# EAGLE board AK-230_24-V3 (EAGLE 5.10), part 1 of 2
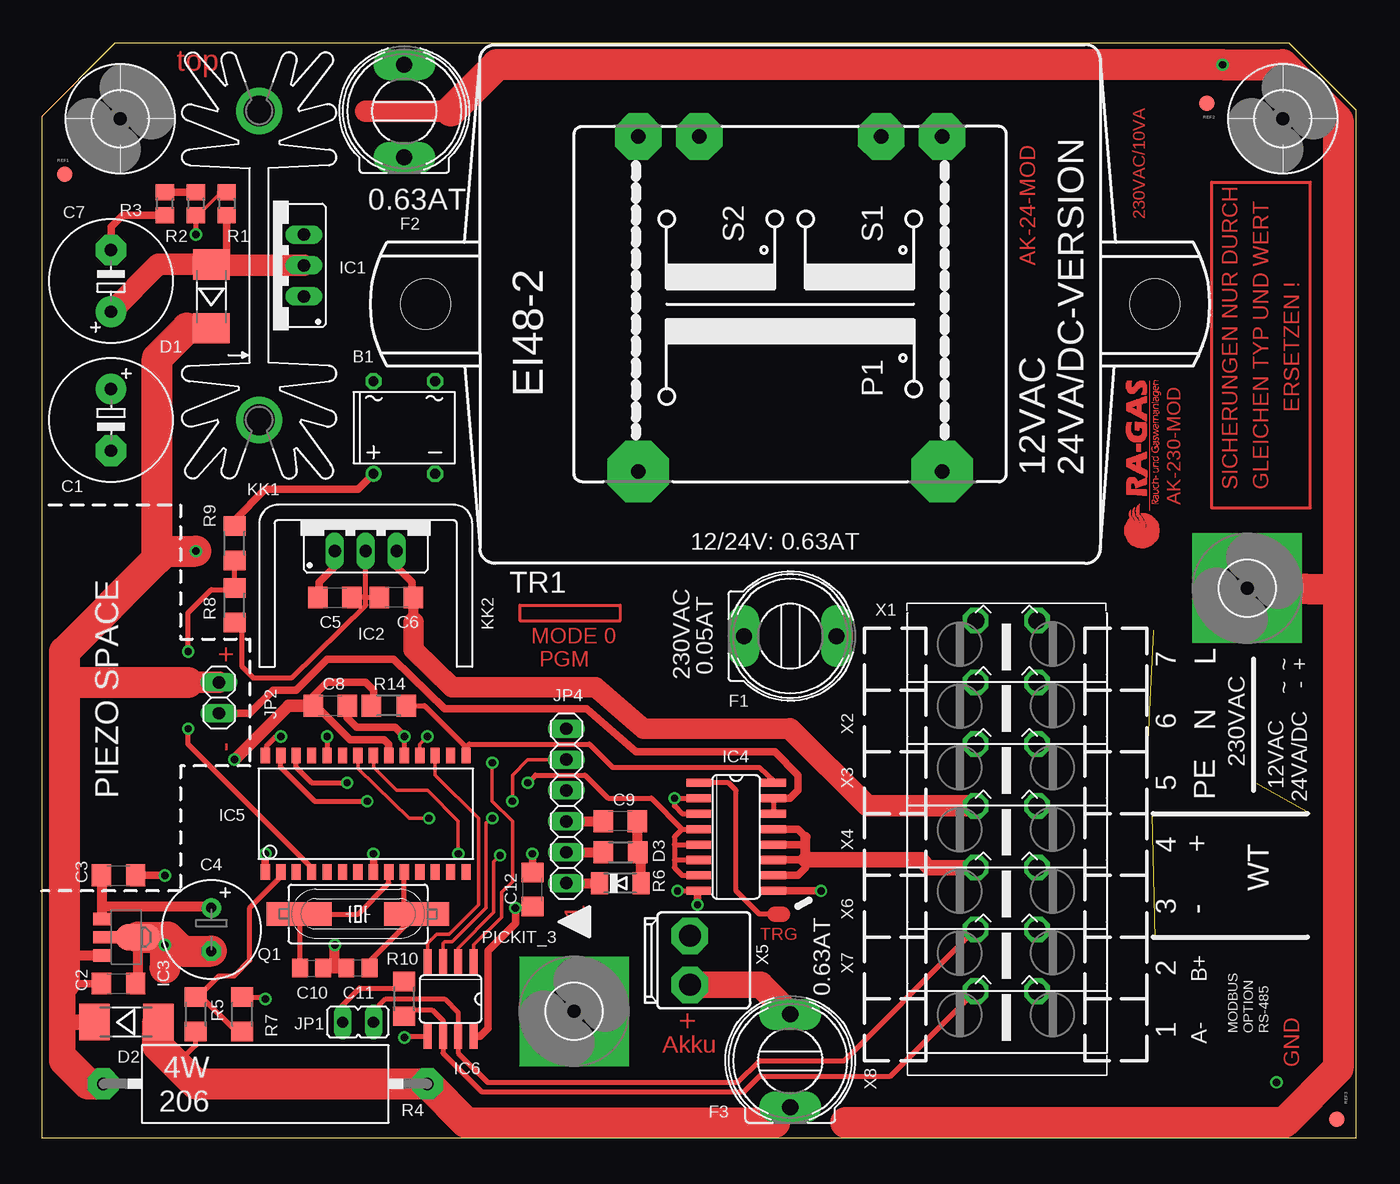
[diagram p1: board, top side]
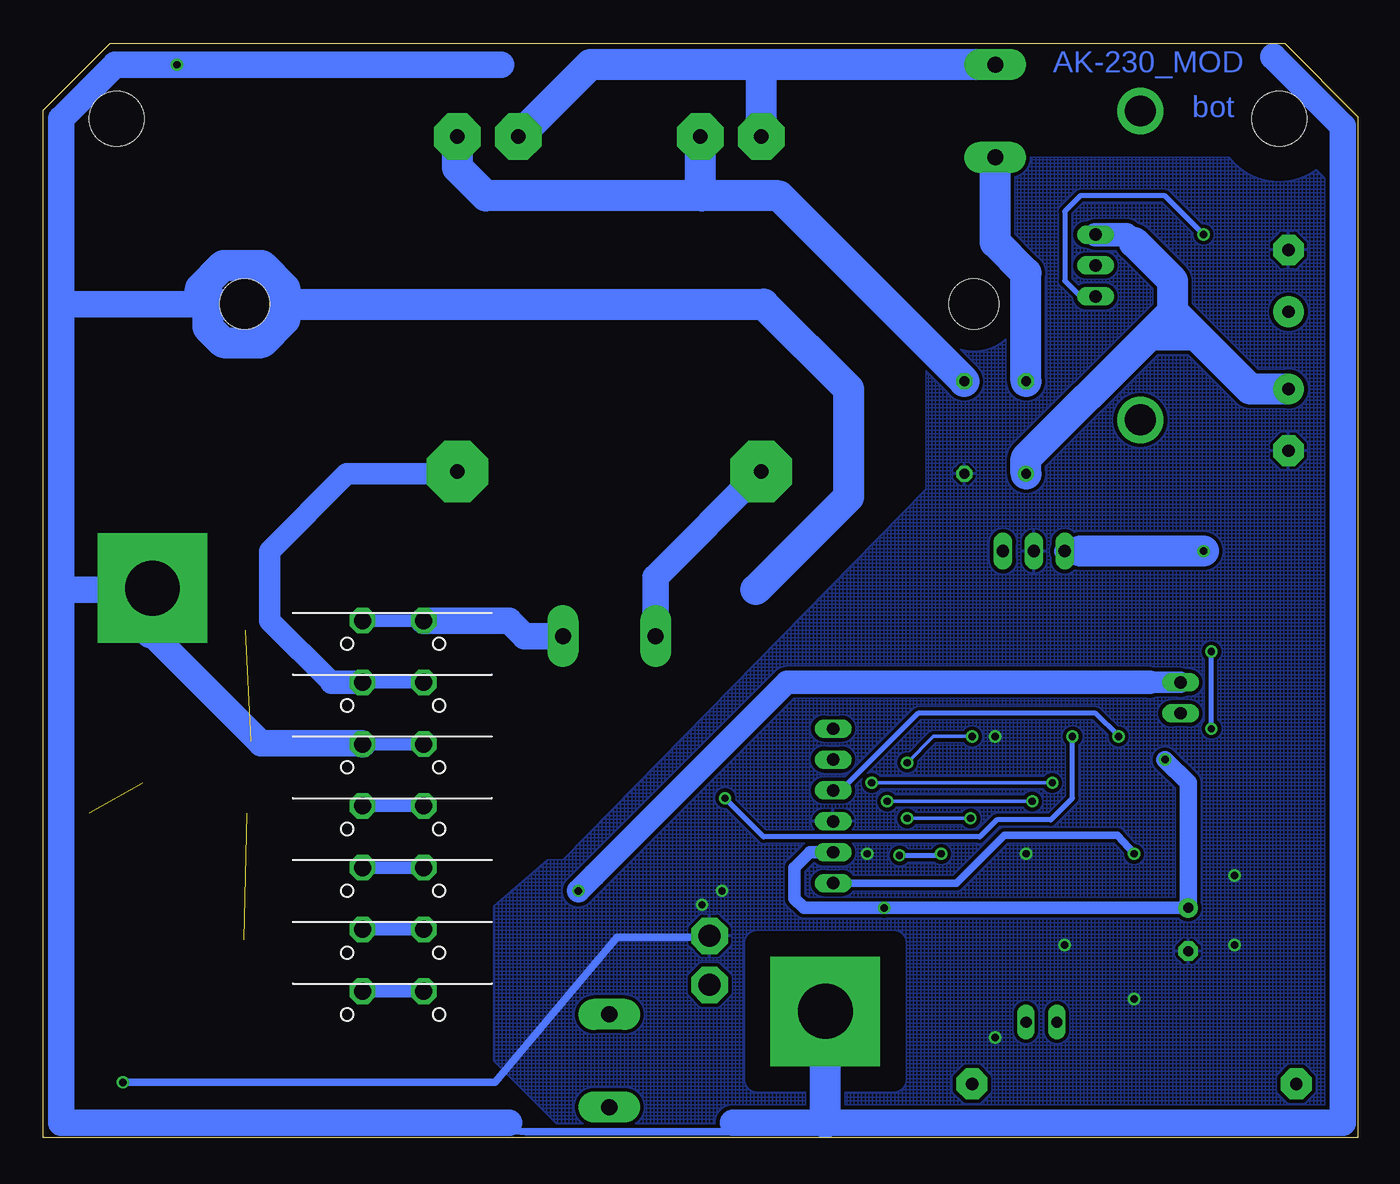
[diagram p2: board, bottom side, seen from below]

Size 108.15 x 90.02 mm. Coordinates in mm from the lower left corner, seen from the top.
Outline: 0,0 108.15,0 108.15,84.5 102.64,90.02 6.03,90.02 0,83.98 0,0
Copper layers (1*16): Top 0.035mm / dielectric 1.5mm / Bottom 0.035mm
Design rules "default *": minimum track width 0.1mm, minimum drill 23mil, track to track 0.3mm, track to pad 0.3mm, pad to pad 8mil, via to via 8mil, smd to smd 8mil, copper to edge 0.2mm, drill to drill 1mm, minimum pad ring 10mil, minimum via ring 8mil, stop-mask expansion 4mil, vias tented up to drill 0mil, thermal gap 10mil

## Footprints (pad centres in the part's own frame; a part is rotated, then mirrored left to right if it is on the bottom)
DB = drill 0.813 round: + -2.54,-3.81 | drill 0.813 octagon: - 2.54,-3.81; AC1 2.54,3.81; AC2 -2.54,3.81
E5-10,5 = drill 1.016 pad 2.54 round: + -2.54,0 | drill 1.016 pad 2.54 octagon: - 2.54,0
C1206 = smd 1.6 x 1.8: 1 -1.4,0; 2 1.4,0
E3,5-8 = drill 0.813 pad 1.6 round: + -1.778,0 | drill 0.813 pad 1.6 octagon: - 1.778,0
C0805 = smd 1.3 x 1.5: 1 -0.95,0; 2 0.95,0
MELF-MLL41 = smd 2.5 x 3: A 2.625,0; C -2.625,0
MINIMELF@1 = smd 1.4 x 1.8: A 1.7,0; C -1.7,0
KS9V = drill 1.321 pad 2.54 long: 1 0,3.81; 2 0,-3.81
4,5-PAD-SQUARE = drill 4.5 pad 9 square: B4,5 0,0
4,5 = hole 4.5: 0,0
317TS = drill 1.016 long: 1 -2.54,-2.54; 2 0,-2.54; 3 2.54,-2.54
78XXS = drill 1.016 long: GND 0,-2.54; IN -2.54,-2.54; OUT 2.54,-2.54
SOT89 = smd 1 x 1.5: 1 -1.499,-1.981; 3 1.499,-1.981 | smd 1 x 2: 2 0,-1.727 | smd 2.2 x 3.7: 2@1 0,0.94
SO16 = smd 0.66 x 2.032: 1 -4.445,-3.073; 2 -3.175,-3.073; 3 -1.905,-3.073; 4 -0.635,-3.073; 5 0.635,-3.073; 6 1.905,-3.073; 7 3.175,-3.073; 8 4.445,-3.073; 9 4.445,3.073; 10 3.175,3.073; 11 1.905,3.073; 12 0.635,3.073; 13 -0.635,3.073; 14 -1.905,3.073; 15 -3.175,3.073; 16 -4.445,3.073
SO28W = smd 0.762 x 1.27: 1 -7.62,-4.78; 2 -6.35,-4.78; 3 -5.08,-4.78; 4 -3.81,-4.78; 5 -2.54,-4.78; 6 -1.27,-4.78; 7 0,-4.78; 8 1.27,-4.78; 9 2.54,-4.78; 10 3.81,-4.78; 11 5.08,-4.78; 12 6.35,-4.78; 13 7.62,-4.78; 14 8.89,-4.78; 15 8.89,4.78; 16 7.62,4.78; 17 6.35,4.78; 18 5.08,4.78; 19 3.81,4.78; 20 2.54,4.78; 21 1.27,4.78; 22 0,4.78; 23 -1.27,4.78; 24 -2.54,4.78; 25 -3.81,4.78; 26 -5.08,4.78; 27 -6.35,4.78; 28 -7.62,4.78
SO08 = smd 0.66 x 2.032: 1 -1.905,-3.073; 2 -0.635,-3.073; 3 0.635,-3.073; 4 1.905,-3.073; 5 1.905,3.073; 6 0.635,3.073; 7 -0.635,3.073; 8 -1.905,3.073
JP1 = drill 0.914 long: 1 0,-1.27; 2 0,1.27
1X02 = drill 1.016 long: 1 -1.27,0; 2 1.27,0
1X06 = drill 1.016 long: 1 -6.35,0; 2 -3.81,0; 3 -1.27,0; 4 1.27,0; 5 3.81,0; 6 6.35,0
SK104-PAD = drill 2.54 pad 3.81 round: K1 -12.7,-0.762; K2 12.7,-0.762
HC49UP = smd 5.334 x 1.93: 1 -4.826,0; 2 4.826,0
R0805 = smd 1.3 x 1.5: 1 -0.95,0; 2 0.95,0
KH206-8 = drill 1.016 pad 2.54 octagon: 1 -13.335,0; 2 13.335,0
R1206 = smd 1.6 x 1.803: 1 -1.422,0; 2 1.422,0
B1,27 = smd 1.27 x 1.27: TP 0,0
EI48-2B = drill 1.194 pad 5.08 octagon: 1 -13.767,12.497; 6 -13.767,-12.497 | drill 1.194 pad 3.81 octagon: 7 13.767,-12.497; 8 13.767,-7.493; 11 13.767,7.493; 12 13.767,12.497 | hole 4.115: 0,-29.997; 0,29.997
AK500/2 = drill 1.4 octagon: 1 -2.515,0; 2 2.515,0
MKS1852-6-0-202 = drill 1.8 pad 3 octagon: 1 -2.012,0; 2 2.012,0

## Placement (x,y rotation side)
B1  DBL103G  [DB]  29.84,58.42 0 top
C1  220µ/35V  [E5-10,5]  5.71,59.05 270 top
C2  100n  [C1206]  6.35,12.7 0 top
C3  100n  [C1206]  6.35,21.59 0 top
C4  220µ25V  [E3,5-8]  13.97,17.14 270 top
C5  100n  [C1206]  24.13,44.45 0 top
C6  100n  [C1206]  29.21,44.45 180 top
C7  1000µ/25V  [E5-10,5]  5.71,70.48 90 top
C8  100n  [C1206]  23.75,35.56 0 top
C9  100n  [C1206]  47.62,26.04 180 top
C10  22p  [C0805]  22.23,13.97 0 top
C11  22p  [C0805]  26.04,13.97 180 top
C12  100n  [C1206]  40.39,20.45 90 top
D1  LL4005G  [MELF-MLL41]  13.97,69.22 90 top
D2  LL4005G  [MELF-MLL41]  6.99,9.53 0 top
D3  1N4148MM  [MINIMELF@1]  47.62,20.95 0 top
F1  0.05AT  [KS9V]  61.59,41.27 270 top
F2  0.63AT  [KS9V]  29.84,84.45 0 top
F3  0.63AT  [KS9V]  61.59,6.35 0 top
H1  MOUNT-PAD-SQUARE4.5  [4,5-PAD-SQUARE]  99.19,45.21 0 top
H2  MOUNT-PAD-SQUARE4.5  [4,5-PAD-SQUARE]  43.81,10.41 0 top
H3  MOUNT-HOLE4.5  [4,5]  102.11,83.82 0 top
H4  MOUNT-HOLE4.5  [4,5]  6.48,83.82 0 top
IC1  LM317T  [317TS]  19.05,71.75 90 top
IC2  TS7810CZ  [78XXS]  26.67,50.8 0 top
IC3  TS78L05ACY  [SOT89]  6.99,16.51 270 top
IC4  ULN2004D  [SO16]  57.15,24.77 270 top
IC5  PIC 16F873A-I/SO  [SO28W]  26.04,26.67 0 top
IC6  MAX481CSA  [SO08]  33.66,11.43 180 top
JP1  [JP1]  26.04,9.53 270 top
JP2  [1X02]  14.61,36.2 270 top
JP4  [1X06]  43.18,27.3 90 top
KK1  SK104-50.8 STS  [SK104-PAD]  17.14,71.75 90 top
KK2  D01S  [D01S]  26.67,50.8 180 top
Q1  4MHz  [HC49UP]  26.04,18.41 180 top
R1  220R 0.1%  [R0805]  15.24,76.83 270 top
R2  120R 0.1%  [R0805]  12.7,76.83 270 top
R3  2k2 0.1%  [R0805]  10.16,76.83 90 top
R4  150R RMO3E150  [KH206-8]  18.41,4.45 180 top
R5  20k  [R1206]  12.7,10.16 270 top
R6  10k  [R1206]  47.62,23.5 180 top
R7  10k  [R1206]  16.51,10.16 270 top
R8  3k3  [R1206]  15.88,43.81 270 top
R9  20k  [R1206]  15.88,48.9 270 top
R10  120R  [R1206]  29.84,11.43 270 top
R14  10k  [R1206]  28.57,35.56 0 top
REF1  TPSB1,27  [B1,27]  1.91,79.25 0 top
REF2  TPSB1,27  [B1,27]  95.89,85.09 180 top
REF3  TPSB1,27  [B1,27]  106.55,1.52 90 top
TR1  MYRRA: MT715-2  [EI48-2B]  61.59,68.58 90 top
X1  [AK500/2]  79.38,42.55 180 top
X2  [AK500/2]  79.38,37.47 180 top
X3  [AK500/2]  79.38,32.38 180 top
X4  [AK500/2]  79.38,27.3 180 top
X5  NSL396M-2G  [MKS1852-6-0-202]  53.34,14.61 90 top
X6  [AK500/2]  79.38,22.23 180 top
X7  [AK500/2]  79.38,17.14 180 top
X8  [AK500/2]  79.38,12.06 180 top

## Tracks (layer width: path | path; a pad name or v marks a point on that pad's centre or on a via)
+5V  (via drill 0.6)
  Top 0.305: C12.1 39.37,19.05 v38.99,18.92
  Top 0.61: IC5.20 28.57,32.38 28.19,32.77 25.4,32.77 22.61,35.56 C8.1 22.35,36.32 23.5,37.47 26.67,37.47 27.3,36.83 27.3,35.71 R14.1 | v38.99,18.92 38.99,17.65 36.73,15.39 36.73,9.04 36.07,8.38 35.59,8.38 IC6.8
  Top 0.813: C3.1 5,21.54 IC3.1 5,18.97 5.08,19.05 13.84,19.05 C4.+ | JP4.2 R6.2
  Top 1.016: v15.88,31.11 20.32,35.56 C8.1
  Bottom 0.254: C4.+ 13.97,19.05
  Bottom 1.016: JP4.2 45.09,23.5 46.35,22.23 46.35,19.68 45.59,18.92 v38.99,18.92 C4.+
  Bottom 1.422: 13.97,19.05 13.97,29.21 v15.88,31.11
/MCLR  (via drill 0.6)
  Top 0.61: IC5.1 v18.41,23.37
  Top 0.813: JP4.1 D3.C
  Bottom 0.61: JP4.1 33.02,20.95 29.08,24.89 19.81,24.89 v18.41,23.37
/RE  (via drill 0.6)
  Top 0.305: IC6.2 34.29,15.62 37.21,18.54 37.21,22.73 v37.72,23.24 | v34.29,23.37 34.29,26.04 31.75,28.57 29.21,28.57 27.3,30.48 IC5.21
  Bottom 0.406: v37.72,23.24 34.42,23.24 v34.29,23.37
A
  Top 0.406: R10.2 29.84,10.54 32.13,10.54 33.02,9.65 IC6.6 33.02,6.99 36.2,3.81 57.78,3.81 59.05,5.08 69.85,5.08 76.83,12.06 X8.2
  Bottom 1.016: X8.2 X8.1
B
  Top 0.406: JP1.2 27.3,10.41 28.32,11.43 33.15,11.43 34.29,10.29 IC6.7 34.29,6.99 36.7,4.57 57.28,4.57 59.05,6.35 66.04,6.35 75.56,15.88 X7.2
  Bottom 1.016: X7.2 X7.1
DE  (via drill 0.6)
  Top 0.305: IC6.3 33.02,16 33.15,16.13 33.78,16.13 36.58,18.92 36.58,25.91 v37.08,26.29 | v31.88,26.29 30.23,26.29 26.04,30.35 IC5.22
  Bottom 0.305: v37.08,26.29 v31.88,26.29
GND  (via drill 0.6)
  Top 0.406: v29.84,33.02 IC5.19 | R7.1 18.26,11.58 v18.41,11.43 | R8.2 16.03,42.39 16.51,42.29 16.51,38.73 17.4,37.85 20.57,37.85 26.67,43.81 26.67,44.45 | 26.67,44.45 IC2.GND | 26.67,44.45 C5.2 | 26.67,44.45 C6.2 | v52.32,20.32 53.98,20.32 | IC6.5 29.95,8.36 v29.84,8.26
  Top 0.61: IC5.8 v27.3,23.37 | v53.98,19.18 53.98,20.22 IC4.8 | C3.2 v10.16,21.59 | R3.1 6.67,75.89 5.71,74.93 C7.- | C8.2 25.15,34.54 25.91,33.78 29.08,33.78 v29.84,33.02 | C12.2 v40.39,23.37
  Top 0.813: IC3.2 IC3.2@1 7.92,12.88 C2.2 | C10.2 24.13,13.97 | 24.13,13.97 C11.2 | 24.13,13.97 v24.13,15.88 | JP4.3 C9.2
  Top 2.54: IC3.2@1 10.16,16.51 | 10.16,16.51 10.41,16.51 11.56,15.37 C4.- | 10.16,16.51 10.16,13.97
  Bottom 0.61: v101.6,4.57 70.99,4.57 60.96,16.51 53.45,16.51 X5.2
  other vias: 10.16,15.88
  pour Bottom (hatched): 0,76.2 4.45,80.64 35.56,80.64 35.56,53.34 65.41,22.86 66.67,22.86 71.12,19.05 71.12,6.35 64.77,0 0,0
LS1  (via drill 0.6)
  Top 0.406: 52.7,25.4 IC4.4 | 52.7,25.4 50.16,27.94 46.61,27.94 44.7,29.84 40.64,29.84 v40.01,29.21 | IC4.7 52.7,21.59 52.07,22.23 52.07,22.86 | 52.07,24.13 52.07,24.77 52.7,25.4 | 52.07,24.13 52.07,22.86 | 52.07,22.86 IC4.6 | 52.07,24.13 IC4.5 | IC5.26 20.95,30.48 22.23,29.21 v25.15,29.21
  Bottom 0.305: v25.15,29.21 v40.01,29.21
N$1
  Bottom 2.54: TR1.7 74.09,79.81 71.75,77.47 53.98,77.47 | 53.98,77.47 47.62,77.47 B1.AC1 | TR1.11 54.1,77.6 53.98,77.47
N$2
  Bottom 2.54: F2.1 48.9,88.27 | 48.9,88.27 63.17,88.27 TR1.8 | TR1.12 49.1,88.06 48.9,88.27
N$4
  Bottom 1.016: X1.2 X1.1
  Bottom 2.184: X1.2 69.85,42.55 68.58,41.27 F1.1
N$5  (1 unrouted)
N$6
  Bottom 1.016: X2.2 X2.1
  Bottom 1.778: 84.45,37.47 89.53,42.55 89.53,48.26 83.19,54.61 74.3,54.61 TR1.6
  Bottom 1.93: X2.1 84.45,37.47
N$7
  Top 0.61: R9.1 15.88,50.8 18.41,53.34 26.04,53.34 B1.+
  Bottom 1.93: IC1.3 19.05,74.3 18.41,73.66
  Bottom 2.54: B1.+ 27.3,55.88 17.14,66.04 | 17.14,66.04 15.24,67.94 | 18.41,73.66 15.24,70.48 15.24,67.94 | C1.+ 8.89,61.59 13.34,66.04 | 15.24,67.94 13.34,66.04 | 17.14,66.04 13.34,66.04
N$8
  Top 0.406: R5.2 12.7,7.62 11.11,6.03
  Top 2.184: F3.2 60.96,2.54 59.69,1.27
  Top 2.54: D2.A 9.53,9.44 9.53,7.62 11.11,6.03 12.7,4.45 R4.1 34.92,1.27 59.69,1.27 60.33,1.27
N$9
  Top 2.184: X5.1 59.16,12.59 F3.1
N$10  (via drill 0.6)
  Top 0.305: 12.89,75.89 14.73,77.72
  Top 0.406: R2.2 v12.7,74.3
  Top 0.61: R2.2 12.89,75.89 | 14.73,77.72 15.18,77.72 R1.1
  Bottom 0.406: IC1.1 22.86,69.22 24.13,70.48 24.13,76.2 22.86,77.47 15.88,77.47 v12.7,74.3
N$11
  Bottom 2.184: 49.1,55.04 TR1.1 57.78,46.13 F1.2
N$12
  Top 0.61: 15.24,71.75 R1.2
  Top 1.778: IC1.2 15.24,71.75 14.05,71.75 D1.A 9.61,71.84 C7.+
N$13
  Top 0.61: R3.2 R2.1
N$14
  Bottom 2.54: B1.AC2 27.3,71.12 29.84,73.66 F2.2
N$15
  Top 0.254: 96.27,78.61 104.39,78.61 104.39,51.82 96.27,51.82 96.27,78.61
N$17
  Top 0.025: 92.09,61.06 92.09,61.27
N$18
  Top 0.406: JP1.1 24.77,10.92 26.16,12.32 29.31,12.32 R10.1
N$19  (via drill 0.6)
  Top 0.406: IC4.3 52.7,26.67 52.07,27.3 v52.07,27.94 IC4.2 | v23.5,33.02 IC5.24
  Bottom 0.406: v23.5,33.02 23.5,27.94 25.27,26.16 29.72,26.16 31.11,24.77 48.9,24.77 v52.07,27.94
N$22
  Top 0.813: D3.A 49.33,23.22 R6.1 49.02,23.52 C9.1
N$23
  Top 0.406: C11.1 26.98,14.54 30.35,17.91 29.84,18.41 IC5.10
  Top 0.813: 30.35,17.91 Q1.1
N$24
  Top 0.406: IC5.2 19.68,21.46 17.14,18.92 17.14,14.61 15.88,13.34 14.61,13.34 12.85,11.58 R5.1 13.18,11.58 15.88,8.89 16.36,8.89 R7.2
N$25
  Top 0.61: 62.87,24.13 62.87,22.86 IC4.11 | 62.87,24.13 62.87,24.77 62.23,25.4 IC4.13 | 62.87,24.13 IC4.12 | IC4.10 62.23,21.59 62.87,22.23 62.87,22.61
  Top 0.813: 62.87,22.61 62.87,22.86 62.87,24.77
  Top 1.27: 62.87,22.86 72.39,22.86 73.03,22.23 X6.2
  Bottom 1.016: X6.2 X6.1
N$26
  Top 0.406: C10.1 21.27,18.35 | IC5.9 28.57,20.95 26.04,18.41 Q1.2
  Top 0.813: 21.27,18.35 Q1.2
N$27
  Top 0.025: 92.06,61.29 92.06,61.32
N$28
  Top 0.025: 92.04,61.32 92.04,61.34
N$29
  Top 0.406: IC4.15 IC4.14
  Top 0.61: IC4.15 61.59,27.94 62.23,28.57 62.23,29.84 60.33,31.75 48.9,31.75 44.83,35.31 33.15,35.31 28.96,39.37 23.5,39.37 20.95,36.83 19.05,36.83 17.14,34.92 JP2.2
N$30
  Top 0.406: IC4.16 60.33,29.31 59.05,30.48 46.99,30.48 45.09,32.38 35.18,32.38 34.92,32.13 | 34.92,31.75 IC5.15 34.92,32.13 | R14.2 31.5,35.56 34.92,32.13
N$31
  Top 0.025: 92.06,61.06 92.06,61.09
N$34
  Top 0.025: 92.01,61.34 92.01,61.37
N$35
  Top 0.025: 91.99,61.34 91.99,61.37
N$36
  Top 0.025: 91.96,49.76 91.96,50.14
N$37
  Top 0.025: 91.96,61.34 91.96,61.37
N$38
  Top 0.025: 91.94,49.61 91.94,50.29
N$39
  Top 0.025: 91.94,61.34 91.94,61.37
N$40  (via drill 0.6)
  Top 0.406: IC5.4 22.23,22.23 12.06,32.38 v12.06,33.66 | v12.06,40.01 12.06,43.18 13.97,45.09 15.72,45.09 R8.1 R9.2
  Bottom 0.406: v12.06,33.66 v12.06,40.01
N$41
  Top 0.025: 91.91,49.53 91.91,50.39
N$42
  Top 0.025: 91.91,52.6 91.91,52.73
N$43
  Top 0.025: 91.91,53.09 91.91,53.19
N$44
  Top 0.025: 91.91,53.57 91.91,53.7
N$45
  Top 0.025: 91.91,54.84 91.91,54.94
N$46
  Top 0.025: 91.91,55.8 91.91,55.88
N$47
  Top 0.025: 91.91,56.59 91.91,56.72
N$48
  Top 0.025: 91.91,57.17 91.91,57.05
N$49
  Top 0.025: 91.91,57.43 91.91,57.53
N$50
  Top 0.025: 91.91,58.45 91.91,58.57
N$51
  Top 0.025: 91.91,59.72 91.91,59.59
N$52
  Top 0.025: 91.91,60.66 91.91,60.78
N$53
  Top 0.025: 91.91,61.14 91.91,61.24
N$54
  Top 0.025: 91.91,61.34 91.91,61.37
N$55
  Top 0.025: 91.91,61.65 91.91,61.75
N$56
  Top 0.025: 91.89,50.47 91.89,49.45
N$57
  Top 0.025: 91.89,52.15 91.89,52.17
N$58
  Top 0.025: 91.89,52.4 91.89,52.45
N$59
  Top 0.025: 91.89,52.55 91.89,52.6
N$60
  Top 0.025: 91.89,52.73 91.89,52.76
N$61
  Top 0.025: 91.89,52.81 91.89,52.86
N$62
  Top 0.025: 91.89,53.01 91.89,53.09
N$63
  Top 0.025: 91.89,53.16 91.89,53.24
N$64
  Top 0.025: 91.89,53.29 91.89,53.31
N$65
  Top 0.025: 91.89,53.52 91.89,53.57
N$66
  Top 0.025: 91.89,53.7 91.89,53.72
N$67
  Top 0.025: 91.89,53.85 91.89,53.87
N$68
  Top 0.025: 91.89,54.15 91.89,54.2
N$69
  Top 0.025: 91.89,54.79 91.89,54.86
N$70
  Top 0.025: 91.89,54.94 91.89,55.02
N$71
  Top 0.025: 91.89,55.04 91.89,55.09
N$72
  Top 0.025: 91.89,55.22 91.89,55.24
N$73
  Top 0.025: 91.89,55.52 91.89,55.58
N$74
  Top 0.025: 91.89,55.75 91.89,55.8
N$75
  Top 0.025: 91.89,55.91 91.89,55.96
N$76
  Top 0.025: 91.89,56.01 91.89,56.03
N$77
  Top 0.025: 91.89,56.52 91.89,56.62
N$78
  Top 0.025: 91.89,56.72 91.89,56.84
N$79
  Top 0.025: 91.89,57 91.89,57.05
N$80
  Top 0.025: 91.89,57.17 91.89,57.2
N$81
  Top 0.025: 91.89,57.25 91.89,57.28
N$82
  Top 0.025: 91.89,57.38 91.89,57.43
N$83
  Top 0.025: 91.89,57.53 91.89,57.58
N$84
  Top 0.025: 91.89,57.81 91.89,57.86
N$85
  Top 0.025: 91.89,58.09 91.89,58.17
N$86
  Top 0.025: 91.89,58.4 91.89,58.45
N$87
  Top 0.025: 91.89,58.55 91.89,58.57
N$88
  Top 0.025: 91.89,58.65 91.89,58.67
N$89
  Top 0.025: 91.89,58.8 91.89,58.83
N$90
  Top 0.025: 91.89,59.08 91.89,59.11
N$91
  Top 0.025: 91.89,59.38 91.89,59.41
N$92
  Top 0.025: 91.89,59.54 91.89,59.59
N$93
  Top 0.025: 91.89,59.72 91.89,59.74
N$94
  Top 0.025: 91.89,59.82 91.89,59.84
N$95
  Top 0.025: 91.89,59.97 91.89,59.99
N$96
  Top 0.025: 91.89,60.27 91.89,60.33
N$97
  Top 0.025: 91.89,60.45 91.89,60.48
N$98
  Top 0.025: 91.89,60.6 91.89,60.66
N$99
  Top 0.025: 91.89,60.78 91.89,60.81
N$100
  Top 0.025: 91.89,60.86 91.89,60.91
N$101
  Top 0.025: 91.89,61.09 91.89,61.14
N$102
  Top 0.025: 91.89,61.24 91.89,61.29
N$103
  Top 0.025: 91.89,61.34 91.89,61.37
N$104
  Top 0.025: 91.89,61.57 91.89,61.65
N$105
  Top 0.025: 91.89,61.75 91.89,61.8
N$106
  Top 0.025: 91.89,61.92 91.89,61.98
N$107
  Top 0.025: 91.89,62.26 91.89,62.28
N$108
  Top 0.025: 91.86,50.52 91.86,49.4
N$109
  Top 0.025: 91.86,52.15 91.86,52.17
N$110
  Top 0.025: 91.86,52.4 91.86,52.43
N$111
  Top 0.025: 91.86,52.53 91.86,52.55
N$112
  Top 0.025: 91.86,52.81 91.86,52.86
N$113
  Top 0.025: 91.86,52.98 91.86,53.03
N$114
  Top 0.025: 91.86,53.24 91.86,53.26
N$115
  Top 0.025: 91.86,53.29 91.86,53.31
N$116
  Top 0.025: 91.86,53.49 91.86,53.52
N$117
  Top 0.025: 91.86,53.85 91.86,53.87
N$118
  Top 0.025: 91.86,54.15 91.86,54.2
N$119
  Top 0.025: 91.86,54.76 91.86,54.79
N$120
  Top 0.025: 91.86,54.99 91.86,55.09
N$121
  Top 0.025: 91.86,55.22 91.86,55.24
N$122
  Top 0.025: 91.86,55.52 91.86,55.58
N$123
  Top 0.025: 91.86,55.73 91.86,55.75
N$124
  Top 0.025: 91.86,55.93 91.86,55.98
N$125
  Top 0.025: 91.86,56.01 91.86,56.03
N$126
  Top 0.025: 91.86,56.46 91.86,56.52
N$127
  Top 0.025: 91.86,56.82 91.86,56.87
N$128
  Top 0.025: 91.86,56.97 91.86,57
N$129
  Top 0.025: 91.86,57.25 91.86,57.28
N$130
  Top 0.025: 91.86,57.58 91.86,57.61
N$131
  Top 0.025: 91.86,57.81 91.86,57.84
N$132
  Top 0.025: 91.86,57.86 91.86,57.89
N$133
  Top 0.025: 91.86,58.09 91.86,58.17
N$134
  Top 0.025: 91.86,58.37 91.86,58.4
N$135
  Top 0.025: 91.86,58.65 91.86,58.67
N$136
  Top 0.025: 91.86,58.8 91.86,58.83
N$137
  Top 0.025: 91.86,59.08 91.86,59.11
N$138
  Top 0.025: 91.86,59.38 91.86,59.41
N$139
  Top 0.025: 91.86,59.51 91.86,59.56
N$140
  Top 0.025: 91.86,59.82 91.86,59.84
N$141
  Top 0.025: 91.86,59.97 91.86,59.99
N$142
  Top 0.025: 91.86,60.3 91.86,60.33
N$143
  Top 0.025: 91.86,60.45 91.86,60.48
N$144
  Top 0.025: 91.86,60.58 91.86,60.63
N$145
  Top 0.025: 91.86,60.86 91.86,60.91
N$146
  Top 0.025: 91.86,61.06 91.86,61.09
N$147
  Top 0.025: 91.86,61.29 91.86,61.32
N$148
  Top 0.025: 91.86,61.37 91.86,61.39
N$149
  Top 0.025: 91.86,61.54 91.86,61.59
N$150
  Top 0.025: 91.86,61.92 91.86,61.98
N$151
  Top 0.025: 91.86,62.26 91.86,62.28
N$152
  Top 0.025: 91.83,50.57 91.83,49.33
N$153
  Top 0.025: 91.83,52.15 91.83,52.17
N$154
  Top 0.025: 91.83,52.38 91.83,52.43
N$155
  Top 0.025: 91.83,52.53 91.83,52.55
N$156
  Top 0.025: 91.83,52.81 91.83,52.86
N$157
  Top 0.025: 91.83,52.98 91.83,53.01
N$158
  Top 0.025: 91.83,53.26 91.83,53.31
N$159
  Top 0.025: 91.83,53.47 91.83,53.49
N$160
  Top 0.025: 91.83,53.85 91.83,53.87
N$161
  Top 0.025: 91.83,54.18 91.83,54.2
N$162
  Top 0.025: 91.83,54.74 91.83,54.76
N$163
  Top 0.025: 91.83,55.02 91.83,55.09
N$164
  Top 0.025: 91.83,55.22 91.83,55.24
N$165
  Top 0.025: 91.83,55.52 91.83,55.58
N$166
  Top 0.025: 91.83,55.7 91.83,55.73
N$167
  Top 0.025: 91.83,55.96 91.83,56.03
N$168
  Top 0.025: 91.83,56.44 91.83,56.49
N$169
  Top 0.025: 91.83,56.82 91.83,56.87
N$170
  Top 0.025: 91.83,56.95 91.83,57
N$171
  Top 0.025: 91.83,57.25 91.83,57.28
N$172
  Top 0.025: 91.83,57.58 91.83,57.61
N$173
  Top 0.025: 91.83,57.78 91.83,57.84
N$174
  Top 0.025: 91.83,57.86 91.83,57.89
N$175
  Top 0.025: 91.83,58.09 91.83,58.12
N$176
  Top 0.025: 91.83,58.14 91.83,58.19
N$177
  Top 0.025: 91.83,58.34 91.83,58.4
N$178
  Top 0.025: 91.83,58.65 91.83,58.67
N$179
  Top 0.025: 91.83,58.8 91.83,58.83
N$180
  Top 0.025: 91.83,59.08 91.83,59.11
N$181
  Top 0.025: 91.83,59.38 91.83,59.41
N$182
  Top 0.025: 91.83,59.51 91.83,59.54
N$183
  Top 0.025: 91.83,59.82 91.83,59.84
N$184
  Top 0.025: 91.83,59.97 91.83,59.99
N$185
  Top 0.025: 91.83,60.3 91.83,60.33
N$186
  Top 0.025: 91.83,60.45 91.83,60.48
N$187
  Top 0.025: 91.83,60.58 91.83,60.6
N$188
  Top 0.025: 91.83,60.88 91.83,60.91
N$189
  Top 0.025: 91.83,61.04 91.83,61.06
N$190
  Top 0.025: 91.83,61.32 91.83,61.39
N$191
  Top 0.025: 91.83,61.52 91.83,61.57
N$192
  Top 0.025: 91.83,61.92 91.83,61.98
N$193
  Top 0.025: 91.83,62.26 91.83,62.28
N$194
  Top 0.025: 91.81,50.62 91.81,49.28
N$195
  Top 0.025: 91.81,52.15 91.81,52.17
N$196
  Top 0.025: 91.81,52.35 91.81,52.4
N$197
  Top 0.025: 91.81,52.5 91.81,52.55
N$198
  Top 0.025: 91.81,52.81 91.81,52.86
N$199
  Top 0.025: 91.81,52.98 91.81,53.01
N$200
  Top 0.025: 91.81,53.26 91.81,53.31
N$201
  Top 0.025: 91.81,53.44 91.81,53.49
N$202
  Top 0.025: 91.81,53.85 91.81,53.87
N$203
  Top 0.025: 91.81,54.18 91.81,54.2
N$204
  Top 0.025: 91.81,54.74 91.81,54.76
N$205
  Top 0.025: 91.81,55.04 91.81,55.09
N$206
  Top 0.025: 91.81,55.22 91.81,55.24
N$207
  Top 0.025: 91.81,55.55 91.81,55.58
N$208
  Top 0.025: 91.81,55.7 91.81,55.73
N$209
  Top 0.025: 91.81,55.98 91.81,56.03
N$210
  Top 0.025: 91.81,56.41 91.81,56.44
N$211
  Top 0.025: 91.81,56.82 91.81,56.87
N$212
  Top 0.025: 91.81,56.95 91.81,57
N$213
  Top 0.025: 91.81,57.25 91.81,57.28
N$214
  Top 0.025: 91.81,57.58 91.81,57.61
N$215
  Top 0.025: 91.81,57.78 91.81,57.81
N$216
  Top 0.025: 91.81,57.86 91.81,57.89
N$217
  Top 0.025: 91.81,58.09 91.81,58.12
N$218
  Top 0.025: 91.81,58.17 91.81,58.19
N$219
  Top 0.025: 91.81,58.34 91.81,58.37
N$220
  Top 0.025: 91.81,58.65 91.81,58.67
N$221
  Top 0.025: 91.81,58.8 91.81,58.83
N$222
  Top 0.025: 91.81,59.08 91.81,59.11
N$223
  Top 0.025: 91.81,59.38 91.81,59.41
N$224
  Top 0.025: 91.81,59.51 91.81,59.54
N$225
  Top 0.025: 91.81,59.82 91.81,59.84
N$226
  Top 0.025: 91.81,59.97 91.81,59.99
N$227
  Top 0.025: 91.81,60.3 91.81,60.33
N$228
  Top 0.025: 91.81,60.45 91.81,60.48
N$229
  Top 0.025: 91.81,60.58 91.81,60.6
N$230
  Top 0.025: 91.81,60.88 91.81,60.91
N$231
  Top 0.025: 91.81,61.01 91.81,61.06
N$232
  Top 0.025: 91.81,61.32 91.81,61.39
N$233
  Top 0.025: 91.81,61.52 91.81,61.54
N$234
  Top 0.025: 91.81,61.92 91.81,61.98
N$235
  Top 0.025: 91.81,62.26 91.81,62.28
N$236
  Top 0.025: 91.78,50.67 91.78,49.23
N$237
  Top 0.025: 91.78,52.15 91.78,52.17
N$238
  Top 0.025: 91.78,52.35 91.78,52.38
N$239
  Top 0.025: 91.78,52.53 91.78,52.55
N$240
  Top 0.025: 91.78,52.83 91.78,52.86
N$241
  Top 0.025: 91.78,52.96 91.78,53.01
N$242
  Top 0.025: 91.78,53.29 91.78,53.31
N$243
  Top 0.025: 91.78,53.44 91.78,53.47
N$244
  Top 0.025: 91.78,53.85 91.78,53.87
N$245
  Top 0.025: 91.78,54.18 91.78,54.2
N$246
  Top 0.025: 91.78,54.74 91.78,54.76
N$247
  Top 0.025: 91.78,55.04 91.78,55.09
N$248
  Top 0.025: 91.78,55.22 91.78,55.24
N$249
  Top 0.025: 91.78,55.55 91.78,55.58
N$250
  Top 0.025: 91.78,55.68 91.78,55.7
N$251
  Top 0.025: 91.78,55.98 91.78,56.03
N$252
  Top 0.025: 91.78,56.39 91.78,56.44
N$253
  Top 0.025: 91.78,56.82 91.78,56.87
N$254
  Top 0.025: 91.78,56.97 91.78,57
N$255
  Top 0.025: 91.78,57.25 91.78,57.28
N$256
  Top 0.025: 91.78,57.58 91.78,57.61
N$257
  Top 0.025: 91.78,57.78 91.78,57.81
N$258
  Top 0.025: 91.78,57.89 91.78,57.91
N$259
  Top 0.025: 91.78,58.06 91.78,58.12
N$260
  Top 0.025: 91.78,58.17 91.78,58.19
N$261
  Top 0.025: 91.78,58.34 91.78,58.4
N$262
  Top 0.025: 91.78,58.65 91.78,58.67
N$263
  Top 0.025: 91.78,58.8 91.78,58.83
N$264
  Top 0.025: 91.78,59.08 91.78,59.11
N$265
  Top 0.025: 91.78,59.38 91.78,59.44
N$266
  Top 0.025: 91.78,59.51 91.78,59.54
N$267
  Top 0.025: 91.78,59.82 91.78,59.84
N$268
  Top 0.025: 91.78,59.97 91.78,59.99
N$269
  Top 0.025: 91.78,60.3 91.78,60.33
N$270
  Top 0.025: 91.78,60.45 91.78,60.48
N$271
  Top 0.025: 91.78,60.58 91.78,60.6
N$272
  Top 0.025: 91.78,60.88 91.78,60.91
N$273
  Top 0.025: 91.78,61.01 91.78,61.04
N$274
  Top 0.025: 91.78,61.34 91.78,61.39
N$275
  Top 0.025: 91.78,61.49 91.78,61.54
N$276
  Top 0.025: 91.78,61.92 91.78,61.98
N$277
  Top 0.025: 91.78,62.26 91.78,62.28
N$278
  Top 0.025: 91.76,50.7 91.76,49.2
N$279
  Top 0.025: 91.76,52.15 91.76,52.17
N$280
  Top 0.025: 91.76,52.32 91.76,52.38
N$281
  Top 0.025: 91.76,52.53 91.76,52.55
N$282
  Top 0.025: 91.76,52.83 91.76,52.86
N$283
  Top 0.025: 91.76,52.96 91.76,53.01
N$284
  Top 0.025: 91.76,53.29 91.76,53.31
N$285
  Top 0.025: 91.76,53.44 91.76,53.47
N$286
  Top 0.025: 91.76,53.85 91.76,53.87
N$287
  Top 0.025: 91.76,54.18 91.76,54.2
N$288
  Top 0.025: 91.76,54.74 91.76,54.76
N$289
  Top 0.025: 91.76,55.07 91.76,55.09
N$290
  Top 0.025: 91.76,55.22 91.76,55.24
N$291
  Top 0.025: 91.76,55.55 91.76,55.58
N$292
  Top 0.025: 91.76,55.68 91.76,55.7
N$293
  Top 0.025: 91.76,56.01 91.76,56.03
N$294
  Top 0.025: 91.76,56.39 91.76,56.41
N$295
  Top 0.025: 91.76,56.82 91.76,56.87
N$296
  Top 0.025: 91.76,56.97 91.76,57
N$297
  Top 0.025: 91.76,57.25 91.76,57.28
N$298
  Top 0.025: 91.76,57.56 91.76,57.61
N$299
  Top 0.025: 91.76,57.76 91.76,57.81
N$300
  Top 0.025: 91.76,57.89 91.76,57.91
N$301
  Top 0.025: 91.76,58.06 91.76,58.09
N$302
  Top 0.025: 91.76,58.19 91.76,58.22
N$303
  Top 0.025: 91.76,58.37 91.76,58.4
N$304
  Top 0.025: 91.76,58.65 91.76,58.67
N$305
  Top 0.025: 91.76,58.8 91.76,58.83
N$306
  Top 0.025: 91.76,59.08 91.76,59.11
N$307
  Top 0.025: 91.76,59.38 91.76,59.44
N$308
  Top 0.025: 91.76,59.54 91.76,59.56
N$309
  Top 0.025: 91.76,59.82 91.76,59.84
N$310
  Top 0.025: 91.76,59.97 91.76,59.99
N$311
  Top 0.025: 91.76,60.3 91.76,60.33
N$312
  Top 0.025: 91.76,60.45 91.76,60.48
N$313
  Top 0.025: 91.76,60.58 91.76,60.63
N$314
  Top 0.025: 91.76,60.88 91.76,60.91
N$315
  Top 0.025: 91.76,61.01 91.76,61.04
N$316
  Top 0.025: 91.76,61.34 91.76,61.39
N$317
  Top 0.025: 91.76,61.49 91.76,61.52
N$318
  Top 0.025: 91.76,61.95 91.76,61.98
N$319
  Top 0.025: 91.76,62.26 91.76,62.28
N$320
  Top 0.025: 91.73,50.75 91.73,49.15
N$321
  Top 0.025: 91.73,52.15 91.73,52.17
N$322
  Top 0.025: 91.73,52.3 91.73,52.35
N$323
  Top 0.025: 91.73,52.55 91.73,52.6
N$324
  Top 0.025: 91.73,52.83 91.73,52.86
N$325
  Top 0.025: 91.73,52.98 91.73,53.01
N$326
  Top 0.025: 91.73,53.29 91.73,53.31
N$327
  Top 0.025: 91.73,53.44 91.73,53.47
N$328
  Top 0.025: 91.73,53.85 91.73,53.87
N$329
  Top 0.025: 91.73,54.18 91.73,54.2
N$330
  Top 0.025: 91.73,54.74 91.73,54.76
N$331
  Top 0.025: 91.73,55.07 91.73,55.09
N$332
  Top 0.025: 91.73,55.22 91.73,55.24
N$333
  Top 0.025: 91.73,55.55 91.73,55.58
N$334
  Top 0.025: 91.73,55.68 91.73,55.7
N$335
  Top 0.025: 91.73,56.01 91.73,56.03
N$336
  Top 0.025: 91.73,56.39 91.73,56.41
N$337
  Top 0.025: 91.73,56.82 91.73,56.87
N$338
  Top 0.025: 91.73,57 91.73,57.05
N$339
  Top 0.025: 91.73,57.25 91.73,57.3
N$340
  Top 0.025: 91.73,57.53 91.73,57.58
N$341
  Top 0.025: 91.73,57.76 91.73,57.78
N$342
  Top 0.025: 91.73,57.91 91.73,57.94
N$343
  Top 0.025: 91.73,58.06 91.73,58.09
N$344
  Top 0.025: 91.73,58.19 91.73,58.22
N$345
  Top 0.025: 91.73,58.4 91.73,58.42
N$346
  Top 0.025: 91.73,58.65 91.73,58.67
N$347
  Top 0.025: 91.73,58.8 91.73,58.83
N$348
  Top 0.025: 91.73,59.08 91.73,59.11
N$349
  Top 0.025: 91.73,59.38 91.73,59.44
N$350
  Top 0.025: 91.73,59.54 91.73,59.59
N$351
  Top 0.025: 91.73,59.82 91.73,59.84
N$352
  Top 0.025: 91.73,59.97 91.73,59.99
N$353
  Top 0.025: 91.73,60.3 91.73,60.33
N$354
  Top 0.025: 91.73,60.45 91.73,60.48
N$355
  Top 0.025: 91.73,60.6 91.73,60.66
N$356
  Top 0.025: 91.73,60.88 91.73,60.91
N$357
  Top 0.025: 91.73,61.01 91.73,61.04
N$358
  Top 0.025: 91.73,61.34 91.73,61.39
N$359
  Top 0.025: 91.73,61.49 91.73,61.52
N$360
  Top 0.025: 91.73,61.95 91.73,61.98
N$361
  Top 0.025: 91.73,62.26 91.73,62.28
N$362
  Top 0.025: 91.71,50.77 91.71,49.1
N$363
  Top 0.025: 91.71,52.15 91.71,52.17
N$364
  Top 0.025: 91.71,52.3 91.71,52.32
N$365
  Top 0.025: 91.71,52.58 91.71,52.65
N$366
  Top 0.025: 91.71,52.83 91.71,52.86
N$367
  Top 0.025: 91.71,52.98 91.71,53.01
N$368
  Top 0.025: 91.71,53.29 91.71,53.31
N$369
  Top 0.025: 91.71,53.44 91.71,53.47
N$370
  Top 0.025: 91.71,53.85 91.71,53.87
N$371
  Top 0.025: 91.71,54.18 91.71,54.2
N$372
  Top 0.025: 91.71,54.28 91.71,54.46
N$373
  Top 0.025: 91.71,54.74 91.71,54.76
N$374
  Top 0.025: 91.71,55.07 91.71,55.09
N$375
  Top 0.025: 91.71,55.22 91.71,55.24
N$376
  Top 0.025: 91.71,55.55 91.71,55.58
N$377
  Top 0.025: 91.71,55.68 91.71,55.7
N$378
  Top 0.025: 91.71,56.01 91.71,56.03
N$379
  Top 0.025: 91.71,56.36 91.71,56.41
N$380
  Top 0.025: 91.71,56.82 91.71,56.87
N$381
  Top 0.025: 91.71,57.02 91.71,57.1
N$382
  Top 0.025: 91.71,57.28 91.71,57.3
N$383
  Top 0.025: 91.71,57.51 91.71,57.56
N$384
  Top 0.025: 91.71,57.76 91.71,57.78
N$385
  Top 0.025: 91.71,57.91 91.71,57.94
N$386
  Top 0.025: 91.71,58.06 91.71,58.09
N$387
  Top 0.025: 91.71,58.22 91.71,58.24
N$388
  Top 0.025: 91.71,58.42 91.71,58.5
N$389
  Top 0.025: 91.71,58.65 91.71,58.67
N$390
  Top 0.025: 91.71,58.8 91.71,58.83
N$391
  Top 0.025: 91.71,59.08 91.71,59.11
N$392
  Top 0.025: 91.71,59.41 91.71,59.44
N$393
  Top 0.025: 91.71,59.59 91.71,59.64
N$394
  Top 0.025: 91.71,59.82 91.71,59.84
N$395
  Top 0.025: 91.71,59.97 91.71,60.02
N$396
  Top 0.025: 91.71,60.3 91.71,60.33
N$397
  Top 0.025: 91.71,60.45 91.71,60.48
N$398
  Top 0.025: 91.71,60.66 91.71,60.71
N$399
  Top 0.025: 91.71,60.88 91.71,60.91
N$400
  Top 0.025: 91.71,61.01 91.71,61.04
N$401
  Top 0.025: 91.71,61.37 91.71,61.39
N$402
  Top 0.025: 91.71,61.49 91.71,61.52
N$403
  Top 0.025: 91.71,61.95 91.71,61.98
N$404
  Top 0.025: 91.71,62.26 91.71,62.28
N$405
  Top 0.025: 91.68,49.07 91.68,50.83
N$406
  Top 0.025: 91.68,52.15 91.68,52.17
N$407
  Top 0.025: 91.68,52.27 91.68,52.3
N$408
  Top 0.025: 91.68,52.65 91.68,52.73
N$409
  Top 0.025: 91.68,52.83 91.68,52.86
N$410
  Top 0.025: 91.68,52.98 91.68,53.01
N$411
  Top 0.025: 91.68,53.29 91.68,53.34
N$412
  Top 0.025: 91.68,53.44 91.68,53.47
N$413
  Top 0.025: 91.68,53.85 91.68,53.87
N$414
  Top 0.025: 91.68,54.18 91.68,54.2
N$415
  Top 0.025: 91.68,54.28 91.68,54.43
N$416
  Top 0.025: 91.68,54.74 91.68,54.76
N$417
  Top 0.025: 91.68,55.07 91.68,55.09
N$418
  Top 0.025: 91.68,55.22 91.68,55.27
N$419
  Top 0.025: 91.68,55.55 91.68,55.58
N$420
  Top 0.025: 91.68,55.68 91.68,55.7
N$421
  Top 0.025: 91.68,56.01 91.68,56.03
N$422
  Top 0.025: 91.68,56.36 91.68,56.41
N$423
  Top 0.025: 91.68,56.84 91.68,56.87
N$424
  Top 0.025: 91.68,57.17 91.68,57.1
N$425
  Top 0.025: 91.68,57.28 91.68,57.3
N$426
  Top 0.025: 91.68,57.45 91.68,57.53
N$427
  Top 0.025: 91.68,57.73 91.68,57.76
N$428
  Top 0.025: 91.68,57.91 91.68,57.94
N$429
  Top 0.025: 91.68,58.04 91.68,58.09
N$430
  Top 0.025: 91.68,58.22 91.68,58.24
N$431
  Top 0.025: 91.68,58.5 91.68,58.57
N$432
  Top 0.025: 91.68,58.65 91.68,58.67
N$433
  Top 0.025: 91.68,58.8 91.68,58.85
N$434
  Top 0.025: 91.68,59.08 91.68,59.11
N$435
  Top 0.025: 91.68,59.41 91.68,59.44
N$436
  Top 0.025: 91.68,59.74 91.68,59.66
N$437
  Top 0.025: 91.68,59.82 91.68,59.84
N$438
  Top 0.025: 91.68,59.97 91.68,60.02
N$439
  Top 0.025: 91.68,60.3 91.68,60.33
N$440
  Top 0.025: 91.68,60.45 91.68,60.48
N$441
  Top 0.025: 91.68,60.71 91.68,60.81
N$442
  Top 0.025: 91.68,60.88 91.68,60.91
N$443
  Top 0.025: 91.68,61.01 91.68,61.04
N$444
  Top 0.025: 91.68,61.37 91.68,61.39
N$445
  Top 0.025: 91.68,61.49 91.68,61.52
N$446
  Top 0.025: 91.68,61.95 91.68,61.98
N$447
  Top 0.025: 91.68,62.26 91.68,62.31
N$448
  Top 0.025: 91.66,49.05 91.66,50.85
N$449
  Top 0.025: 91.66,52.15 91.66,52.17
N$450
  Top 0.025: 91.66,52.25 91.66,52.3
N$451
  Top 0.025: 91.66,52.76 91.66,52.81
N$452
  Top 0.025: 91.66,52.83 91.66,52.86
N$453
  Top 0.025: 91.66,52.98 91.66,53.01
N$454
  Top 0.025: 91.66,53.29 91.66,53.34
N$455
  Top 0.025: 91.66,53.44 91.66,53.47
N$456
  Top 0.025: 91.66,53.85 91.66,53.87
N$457
  Top 0.025: 91.66,54.18 91.66,54.2
N$458
  Top 0.025: 91.66,54.74 91.66,54.76
N$459
  Top 0.025: 91.66,55.07 91.66,55.09
N$460
  Top 0.025: 91.66,55.22 91.66,55.27
N$461
  Top 0.025: 91.66,55.55 91.66,55.58
N$462
  Top 0.025: 91.66,55.68 91.66,55.73
N$463
  Top 0.025: 91.66,56.01 91.66,56.03
N$464
  Top 0.025: 91.66,56.36 91.66,56.41
N$465
  Top 0.025: 91.66,56.84 91.66,56.87
N$466
  Top 0.025: 91.66,57.2 91.66,57.3
N$467
  Top 0.025: 91.66,57.43 91.66,57.48
N$468
  Top 0.025: 91.66,57.73 91.66,57.76
N$469
  Top 0.025: 91.66,57.94 91.66,57.96
N$470
  Top 0.025: 91.66,58.04 91.66,58.06
N$471
  Top 0.025: 91.66,58.24 91.66,58.27
N$472
  Top 0.025: 91.66,58.57 91.66,58.7
N$473
  Top 0.025: 91.66,58.8 91.66,58.85
N$474
  Top 0.025: 91.66,59.08 91.66,59.13
N$475
  Top 0.025: 91.66,59.41 91.66,59.44
N$476
  Top 0.025: 91.66,59.74 91.66,59.79
N$477
  Top 0.025: 91.66,59.82 91.66,59.84
N$478
  Top 0.025: 91.66,59.97 91.66,60.02
N$479
  Top 0.025: 91.66,60.3 91.66,60.33
N$480
  Top 0.025: 91.66,60.45 91.66,60.48
N$481
  Top 0.025: 91.66,60.81 91.66,60.86
N$482
  Top 0.025: 91.66,60.88 91.66,60.91
N$483
  Top 0.025: 91.66,61.01 91.66,61.06
N$484
  Top 0.025: 91.66,61.37 91.66,61.39
N$485
  Top 0.025: 91.66,61.49 91.66,61.85
N$486
  Top 0.025: 91.66,61.95 91.66,61.98
N$487
  Top 0.025: 91.66,62.26 91.66,62.31
N$488
  Top 0.025: 91.63,49.02 91.63,50.88
N$489
  Top 0.025: 91.63,52.15 91.63,52.17
N$490
  Top 0.025: 91.63,52.22 91.63,52.35
N$491
  Top 0.025: 91.63,52.81 91.63,52.86
N$492
  Top 0.025: 91.63,52.98 91.63,53.01
N$493
  Top 0.025: 91.63,53.29 91.63,53.34
N$494
  Top 0.025: 91.63,53.44 91.63,53.47
N$495
  Top 0.025: 91.63,53.85 91.63,53.9
N$496
  Top 0.025: 91.63,54.18 91.63,54.2
N$497
  Top 0.025: 91.63,54.74 91.63,54.76
N$498
  Top 0.025: 91.63,55.07 91.63,55.09
N$499
  Top 0.025: 91.63,55.22 91.63,55.27
N$500
  Top 0.025: 91.63,55.55 91.63,55.58
N$501
  Top 0.025: 91.63,55.7 91.63,55.73
N$502
  Top 0.025: 91.63,56.01 91.63,56.03
N$503
  Top 0.025: 91.63,56.36 91.63,56.41
N$504
  Top 0.025: 91.63,56.69 91.63,56.87
N$505
  Top 0.025: 91.63,57.25 91.63,57.3
N$506
  Top 0.025: 91.63,57.43 91.63,57.45
N$507
  Top 0.025: 91.63,57.71 91.63,57.76
N$508
  Top 0.025: 91.63,57.94 91.63,57.96
N$509
  Top 0.025: 91.63,58.04 91.63,58.06
N$510
  Top 0.025: 91.63,58.24 91.63,58.27
N$511
  Top 0.025: 91.63,58.65 91.63,58.7
N$512
  Top 0.025: 91.63,58.8 91.63,58.85
N$513
  Top 0.025: 91.63,59.08 91.63,59.13
N$514
  Top 0.025: 91.63,59.41 91.63,59.44
N$515
  Top 0.025: 91.63,59.82 91.63,59.84
N$516
  Top 0.025: 91.63,59.97 91.63,60.02
N$517
  Top 0.025: 91.63,60.3 91.63,60.33
N$518
  Top 0.025: 91.63,60.45 91.63,60.48
N$519
  Top 0.025: 91.63,60.86 91.63,60.91
N$520
  Top 0.025: 91.63,61.04 91.63,61.06
N$521
  Top 0.025: 91.63,61.37 91.63,61.39
N$522
  Top 0.025: 91.63,61.49 91.63,61.54
N$523
  Top 0.025: 91.63,61.82 91.63,61.85
N$524
  Top 0.025: 91.63,61.95 91.63,61.98
N$525
  Top 0.025: 91.63,62.26 91.63,62.31
N$526
  Top 0.025: 91.61,49 91.61,50.93
N$527
  Top 0.025: 91.61,52.15 91.61,52.17
N$528
  Top 0.025: 91.61,52.35 91.61,52.4
N$529
  Top 0.025: 91.61,52.83 91.61,52.86
N$530
  Top 0.025: 91.61,52.98 91.61,53.01
N$531
  Top 0.025: 91.61,53.29 91.61,53.34
N$532
  Top 0.025: 91.61,53.44 91.61,53.49
N$533
  Top 0.025: 91.61,53.85 91.61,53.9
N$534
  Top 0.025: 91.61,54.18 91.61,54.2
N$535
  Top 0.025: 91.61,54.74 91.61,54.76
N$536
  Top 0.025: 91.61,55.07 91.61,55.09
N$537
  Top 0.025: 91.61,55.22 91.61,55.27
N$538
  Top 0.025: 91.61,55.55 91.61,55.58
N$539
  Top 0.025: 91.61,55.7 91.61,55.73
N$540
  Top 0.025: 91.61,56.01 91.61,56.03
N$541
  Top 0.025: 91.61,56.36 91.61,56.41
N$542
  Top 0.025: 91.61,56.72 91.61,56.82
N$543
  Top 0.025: 91.61,57.28 91.61,57.3
N$544
  Top 0.025: 91.61,57.4 91.61,57.45
N$545
  Top 0.025: 91.61,57.71 91.61,57.73
N$546
  Top 0.025: 91.61,57.94 91.61,57.96
N$547
  Top 0.025: 91.61,58.01 91.61,58.06
N$548
  Top 0.025: 91.61,58.24 91.61,58.29
N$549
  Top 0.025: 91.61,58.65 91.61,58.7
N$550
  Top 0.025: 91.61,58.8 91.61,58.85
N$551
  Top 0.025: 91.61,59.08 91.61,59.13
N$552
  Top 0.025: 91.61,59.41 91.61,59.44
N$553
  Top 0.025: 91.61,59.82 91.61,59.84
N$554
  Top 0.025: 91.61,59.97 91.61,60.02
N$555
  Top 0.025: 91.61,60.3 91.61,60.33
N$556
  Top 0.025: 91.61,60.45 91.61,60.48
N$557
  Top 0.025: 91.61,60.88 91.61,60.91
N$558
  Top 0.025: 91.61,61.04 91.61,61.09
N$559
  Top 0.025: 91.61,61.37 91.61,61.39
N$560
  Top 0.025: 91.61,61.52 91.61,61.54
N$561
  Top 0.025: 91.61,61.8 91.61,61.85
N$562
  Top 0.025: 91.61,61.95 91.61,62
N$563
  Top 0.025: 91.61,62.26 91.61,62.31
N$564
  Top 0.025: 91.58,48.97 91.58,50.95
N$565
  Top 0.025: 91.58,52.15 91.58,52.17
N$566
  Top 0.025: 91.58,52.4 91.58,52.43
N$567
  Top 0.025: 91.58,52.83 91.58,52.86
N$568
  Top 0.025: 91.58,52.98 91.58,53.01
N$569
  Top 0.025: 91.58,53.29 91.58,53.34
N$570
  Top 0.025: 91.58,53.47 91.58,53.49
N$571
  Top 0.025: 91.58,53.85 91.58,53.9
N$572
  Top 0.025: 91.58,54.18 91.58,54.2
N$573
  Top 0.025: 91.58,54.74 91.58,54.76
N$574
  Top 0.025: 91.58,55.07 91.58,55.09
N$575
  Top 0.025: 91.58,55.22 91.58,55.3
N$576
  Top 0.025: 91.58,55.55 91.58,55.58
N$577
  Top 0.025: 91.58,55.73 91.58,55.75
N$578
  Top 0.025: 91.58,56.01 91.58,56.03
N$579
  Top 0.025: 91.58,56.39 91.58,56.41
N$580
  Top 0.025: 91.58,57.28 91.58,57.3
N$581
  Top 0.025: 91.58,57.4 91.58,57.43
N$582
  Top 0.025: 91.58,57.71 91.58,57.73
N$583
  Top 0.025: 91.58,57.96 91.58,57.99
N$584
  Top 0.025: 91.58,58.01 91.58,58.04
N$585
  Top 0.025: 91.58,58.27 91.58,58.29
N$586
  Top 0.025: 91.58,58.67 91.58,58.7
N$587
  Top 0.025: 91.58,58.8 91.58,58.85
N$588
  Top 0.025: 91.58,59.08 91.58,59.16
N$589
  Top 0.025: 91.58,59.38 91.58,59.44
N$590
  Top 0.025: 91.58,59.82 91.58,59.84
N$591
  Top 0.025: 91.58,59.99 91.58,60.05
N$592
  Top 0.025: 91.58,60.3 91.58,60.33
N$593
  Top 0.025: 91.58,60.45 91.58,60.48
N$594
  Top 0.025: 91.58,60.88 91.58,60.91
N$595
  Top 0.025: 91.58,61.06 91.58,61.09
N$596
  Top 0.025: 91.58,61.37 91.58,61.39
N$597
  Top 0.025: 91.58,61.52 91.58,61.54
N$598
  Top 0.025: 91.58,61.8 91.58,61.82
N$599
  Top 0.025: 91.58,61.95 91.58,62
N$600
  Top 0.025: 91.58,62.26 91.58,62.28
N$601
  Top 0.025: 91.55,48.95 91.55,50.98
N$602
  Top 0.025: 91.55,52.15 91.55,52.17
N$603
  Top 0.025: 91.55,52.43 91.55,52.45
N$604
  Top 0.025: 91.55,52.83 91.55,52.86
N$605
  Top 0.025: 91.55,52.98 91.55,53.01
N$606
  Top 0.025: 91.55,53.29 91.55,53.34
N$607
  Top 0.025: 91.55,53.49 91.55,53.52
N$608
  Top 0.025: 91.55,53.85 91.55,53.87
N$609
  Top 0.025: 91.55,53.9 91.55,53.92
N$610
  Top 0.025: 91.55,54.15 91.55,54.2
N$611
  Top 0.025: 91.55,54.74 91.55,54.79
N$612
  Top 0.025: 91.55,55.07 91.55,55.09
N$613
  Top 0.025: 91.55,55.22 91.55,55.32
N$614
  Top 0.025: 91.55,55.52 91.55,55.55
N$615
  Top 0.025: 91.55,55.75 91.55,55.78
N$616
  Top 0.025: 91.55,56.01 91.55,56.03
N$617
  Top 0.025: 91.55,56.39 91.55,56.41
N$618
  Top 0.025: 91.55,57.28 91.55,57.3
N$619
  Top 0.025: 91.55,57.4 91.55,57.43
N$620
  Top 0.025: 91.55,57.68 91.55,57.73
N$621
  Top 0.025: 91.55,57.96 91.55,57.99
N$622
  Top 0.025: 91.55,58.01 91.55,58.04
N$623
  Top 0.025: 91.55,58.27 91.55,58.32
N$624
  Top 0.025: 91.55,58.65 91.55,58.67
N$625
  Top 0.025: 91.55,58.8 91.55,58.88
N$626
  Top 0.025: 91.55,59.08 91.55,59.16
N$627
  Top 0.025: 91.55,59.38 91.55,59.41
N$628
  Top 0.025: 91.55,59.82 91.55,59.84
N$629
  Top 0.025: 91.55,59.99 91.55,60.07
N$630
  Top 0.025: 91.55,60.27 91.55,60.33
N$631
  Top 0.025: 91.55,60.45 91.55,60.48
N$632
  Top 0.025: 91.55,60.88 91.55,60.91
N$633
  Top 0.025: 91.55,61.09 91.55,61.11
N$634
  Top 0.025: 91.55,61.37 91.55,61.39
N$635
  Top 0.025: 91.55,61.54 91.55,61.57
N$636
  Top 0.025: 91.55,61.8 91.55,61.82
N$637
  Top 0.025: 91.55,61.95 91.55,61.98
N$638
  Top 0.025: 91.55,62 91.55,62.03
N$639
  Top 0.025: 91.55,62.26 91.55,62.28
N$640
  Top 0.025: 91.53,48.92 91.53,51
N$641
  Top 0.025: 91.53,52.15 91.53,52.17
N$642
  Top 0.025: 91.53,52.43 91.53,52.45
N$643
  Top 0.025: 91.53,52.58 91.53,52.6
N$644
  Top 0.025: 91.53,52.81 91.53,52.83
N$645
  Top 0.025: 91.53,52.98 91.53,53.01
N$646
  Top 0.025: 91.53,53.29 91.53,53.34
N$647
  Top 0.025: 91.53,53.52 91.53,53.54
N$648
  Top 0.025: 91.53,53.85 91.53,53.87
N$649
  Top 0.025: 91.53,53.92 91.53,53.98
N$650
  Top 0.025: 91.53,54.13 91.53,54.18
N$651
  Top 0.025: 91.53,54.74 91.53,54.79
N$652
  Top 0.025: 91.53,55.07 91.53,55.09
N$653
  Top 0.025: 91.53,55.22 91.53,55.27
N$654
  Top 0.025: 91.53,55.3 91.53,55.35
N$655
  Top 0.025: 91.53,55.5 91.53,55.55
N$656
  Top 0.025: 91.53,55.78 91.53,55.83
N$657
  Top 0.025: 91.53,56.01 91.53,56.03
N$658
  Top 0.025: 91.53,56.39 91.53,56.41
N$659
  Top 0.025: 91.53,57.02 91.53,57.05
N$660
  Top 0.025: 91.53,57.23 91.53,57.28
N$661
  Top 0.025: 91.53,57.43 91.53,57.45
N$662
  Top 0.025: 91.53,57.68 91.53,57.71
N$663
  Top 0.025: 91.53,57.96 91.53,58.04
N$664
  Top 0.025: 91.53,58.29 91.53,58.32
N$665
  Top 0.025: 91.53,58.42 91.53,58.45
N$666
  Top 0.025: 91.53,58.62 91.53,58.67
N$667
  Top 0.025: 91.53,58.8 91.53,58.85
N$668
  Top 0.025: 91.53,58.88 91.53,58.9
N$669
  Top 0.025: 91.53,59.08 91.53,59.13
N$670
  Top 0.025: 91.53,59.16 91.53,59.21
N$671
  Top 0.025: 91.53,59.33 91.53,59.38
N$672
  Top 0.025: 91.53,59.56 91.53,59.59
N$673
  Top 0.025: 91.53,59.79 91.53,59.84
N$674
  Top 0.025: 91.53,59.99 91.53,60.02
N$675
  Top 0.025: 91.53,60.05 91.53,60.1
N$676
  Top 0.025: 91.53,60.25 91.53,60.3
N$677
  Top 0.025: 91.53,60.45 91.53,60.48
N$678
  Top 0.025: 91.53,60.63 91.53,60.66
N$679
  Top 0.025: 91.53,60.86 91.53,60.88
N$680
  Top 0.025: 91.53,61.11 91.53,61.16
N$681
  Top 0.025: 91.53,61.37 91.53,61.39
N$682
  Top 0.025: 91.53,61.57 91.53,61.62
N$683
  Top 0.025: 91.53,61.75 91.53,61.8
N$684
  Top 0.025: 91.53,61.95 91.53,61.98
N$685
  Top 0.025: 91.53,62.03 91.53,62.08
N$686
  Top 0.025: 91.53,62.26 91.53,62.2
N$687
  Top 0.025: 91.5,48.9 91.5,51
N$688
  Top 0.025: 91.5,52.15 91.5,52.2
N$689
  Top 0.025: 91.5,52.43 91.5,52.48
N$690
  Top 0.025: 91.5,52.6 91.5,52.81
N$691
  Top 0.025: 91.5,52.98 91.5,53.01
N$692
  Top 0.025: 91.5,53.31 91.5,53.34
N$693
  Top 0.025: 91.5,53.54 91.5,53.72
N$694
  Top 0.025: 91.5,53.85 91.5,53.87
N$695
  Top 0.025: 91.5,53.98 91.5,54.13
N$696
  Top 0.025: 91.5,54.74 91.5,54.76
N$697
  Top 0.025: 91.5,55.07 91.5,55.09
N$698
  Top 0.025: 91.5,55.24 91.5,55.27
N$699
  Top 0.025: 91.5,55.35 91.5,55.5
N$700
  Top 0.025: 91.5,55.83 91.5,56.03
N$701
  Top 0.025: 91.5,56.41 91.5,56.44
N$702
  Top 0.025: 91.5,57.25 91.5,57.05
N$703
  Top 0.025: 91.5,57.45 91.5,57.61
N$704
  Top 0.025: 91.5,57.68 91.5,57.71
N$705
  Top 0.025: 91.5,57.99 91.5,58.04
N$706
  Top 0.025: 91.5,58.29 91.5,58.32
N$707
  Top 0.025: 91.5,58.42 91.5,58.62
N$708
  Top 0.025: 91.5,58.8 91.5,58.83
N$709
  Top 0.025: 91.5,58.9 91.5,59
N$710
  Top 0.025: 91.5,59.08 91.5,59.11
N$711
  Top 0.025: 91.5,59.21 91.5,59.36
N$712
  Top 0.025: 91.5,59.79 91.5,59.59
N$713
  Top 0.025: 91.5,59.99 91.5,60.02
N$714
  Top 0.025: 91.5,60.1 91.5,60.25
N$715
  Top 0.025: 91.5,60.45 91.5,60.48
N$716
  Top 0.025: 91.5,60.66 91.5,60.86
N$717
  Top 0.025: 91.5,61.16 91.5,61.39
N$718
  Top 0.025: 91.5,61.62 91.5,61.75
N$719
  Top 0.025: 91.5,61.95 91.5,61.98
N$720
  Top 0.025: 91.5,62.23 91.5,62.05
N$721
  Top 0.025: 91.48,48.87 91.48,51.03
N$722
  Top 0.025: 91.48,52.15 91.48,52.2
N$723
  Top 0.025: 91.48,52.43 91.48,52.48
N$724
  Top 0.025: 91.48,53.85 91.48,53.9
N$725
  Top 0.025: 91.48,56.01 91.48,56.03
N$726
  Top 0.025: 91.48,56.41 91.48,56.46
N$727
  Top 0.025: 91.48,60.45 91.48,60.5
N$728
  Top 0.025: 91.45,48.84 91.45,51.05
N$729
  Top 0.025: 91.45,52.15 91.45,52.2
N$730
  Top 0.025: 91.45,52.43 91.45,52.45
N$731
  Top 0.025: 91.45,53.85 91.45,53.9
N$732
  Top 0.025: 91.45,56.01 91.45,56.03
N$733
  Top 0.025: 91.45,56.44 91.45,56.46
N$734
  Top 0.025: 91.45,60.45 91.45,60.5
N$735
  Top 0.025: 91.43,48.82 91.43,51.08
N$736
  Top 0.025: 91.43,52.15 91.43,52.2
N$737
  Top 0.025: 91.43,52.43 91.43,52.45
N$738
  Top 0.025: 91.43,53.85 91.43,53.9
N$739
  Top 0.025: 91.43,56.01 91.43,56.03
N$740
  Top 0.025: 91.43,56.46 91.43,56.49
N$741
  Top 0.025: 91.43,60.45 91.43,60.5
N$742
  Top 0.025: 91.4,48.79 91.4,51.1
N$743
  Top 0.025: 91.4,52.15 91.4,52.2
N$744
  Top 0.025: 91.4,52.4 91.4,52.45
N$745
  Top 0.025: 91.4,53.85 91.4,53.9
N$746
  Top 0.025: 91.4,56.01 91.4,56.03
N$747
  Top 0.025: 91.4,56.49 91.4,56.54
N$748
  Top 0.025: 91.4,60.45 91.4,60.5
N$749
  Top 0.025: 91.38,48.79 91.38,51.13
N$750
  Top 0.025: 91.38,52.15 91.38,52.43
N$751
  Top 0.025: 91.38,53.85 91.38,53.9
N$752
  Top 0.025: 91.38,56.01 91.38,56.06
N$753
  Top 0.025: 91.38,56.54 91.38,56.64
N$754
  Top 0.025: 91.38,56.72 91.38,56.84
N$755
  Top 0.025: 91.38,60.45 91.38,60.5
N$756
  Top 0.025: 91.35,48.77 91.35,51.13
N$757
  Top 0.025: 91.35,56.64 91.35,56.74
N$758
  Top 0.025: 91.33,48.74 91.33,51.16
N$759
  Top 0.025: 91.3,48.72 91.3,51.16
N$760
  Top 0.025: 91.28,48.72 91.28,51.18
N$761
  Top 0.025: 91.25,48.69 91.25,51.21
N$762
  Top 0.025: 91.22,48.69 91.22,51.21
N$763
  Top 0.025: 91.2,48.67 91.2,51.23
N$764
  Top 0.025: 91.17,48.67 91.17,51.23
N$765
  Top 0.025: 91.17,51.59 91.17,62.28
N$766
  Top 0.025: 91.15,48.64 91.15,51.26
N$767
  Top 0.025: 91.12,48.64 91.12,51.26
N$768
  Top 0.025: 91.1,48.62 91.1,51.28
N$769
  Top 0.025: 91.07,48.62 91.07,51.28
N$770
  Top 0.025: 91.05,48.62 91.05,51.28
N$771
  Top 0.025: 91.02,48.59 91.02,51.31
N$772
  Top 0.025: 91,48.59 91,51.31
N$773
  Top 0.025: 90.97,48.59 90.97,51.33
N$774
  Top 0.025: 90.94,48.56 90.94,51.33
N$775
  Top 0.025: 90.94,57.94 90.94,58.5
N$776
  Top 0.025: 90.94,61.39 90.94,61.82
N$777
  Top 0.025: 90.92,48.56 90.92,51.33
N$778
  Top 0.025: 90.92,52.81 90.92,53.31
N$779
  Top 0.025: 90.92,53.75 90.92,54.28
N$780
  Top 0.025: 90.92,54.89 90.92,54.33
N$781
  Top 0.025: 90.92,55.88 90.92,56.41
N$782
  Top 0.025: 90.92,57.76 90.92,58.73
N$783
  Top 0.025: 90.92,58.93 90.92,59.51
N$784
  Top 0.025: 90.92,60.48 90.92,61.01
N$785
  Top 0.025: 90.92,61.24 90.92,61.95
N$786
  Top 0.025: 90.89,50.29 90.89,48.56
N$787
  Top 0.025: 90.89,50.52 90.89,51.33
N$788
  Top 0.025: 90.89,52.81 90.89,53.34
N$789
  Top 0.025: 90.89,53.75 90.89,54.28
N$790
  Top 0.025: 90.89,54.91 90.89,54.36
N$791
  Top 0.025: 90.89,55.88 90.89,56.41
N$792
  Top 0.025: 90.89,57.68 90.89,58.85
N$793
  Top 0.025: 90.89,58.95 90.89,59.51
N$794
  Top 0.025: 90.89,60.48 90.89,61.01
N$795
  Top 0.025: 90.89,61.14 90.89,62
N$796
  Top 0.025: 90.87,50.16 90.87,48.56
N$797
  Top 0.025: 90.87,50.65 90.87,51.36
N$798
  Top 0.025: 90.87,52.81 90.87,53.34
N$799
  Top 0.025: 90.87,53.72 90.87,54.28
N$800
  Top 0.025: 90.87,54.91 90.87,54.36
N$801
  Top 0.025: 90.87,55.85 90.87,56.41
N$802
  Top 0.025: 90.87,57.61 90.87,58.85
N$803
  Top 0.025: 90.87,58.95 90.87,59.54
N$804
  Top 0.025: 90.87,60.45 90.87,61.01
N$805
  Top 0.025: 90.87,61.14 90.87,62.05
N$806
  Top 0.025: 90.84,50.09 90.84,48.54
N$807
  Top 0.025: 90.84,50.72 90.84,51.36
N$808
  Top 0.025: 90.84,52.83 90.84,53.34
N$809
  Top 0.025: 90.84,53.72 90.84,54.25
N$810
  Top 0.025: 90.84,54.94 90.84,54.38
N$811
  Top 0.025: 90.84,55.85 90.84,56.39
N$812
  Top 0.025: 90.84,57.56 90.84,58.85
N$813
  Top 0.025: 90.84,58.98 90.84,59.54
N$814
  Top 0.025: 90.84,60.45 90.84,60.98
N$815
  Top 0.025: 90.84,61.14 90.84,62.1
N$816
  Top 0.025: 90.82,50.04 90.82,48.54
N$817
  Top 0.025: 90.82,50.77 90.82,51.36
N$818
  Top 0.025: 90.82,52.83 90.82,53.34
N$819
  Top 0.025: 90.82,53.72 90.82,54.25
N$820
  Top 0.025: 90.82,54.94 90.82,54.38
N$821
  Top 0.025: 90.82,55.85 90.82,56.39
N$822
  Top 0.025: 90.82,57.51 90.82,58.85
N$823
  Top 0.025: 90.82,58.98 90.82,59.54
N$824
  Top 0.025: 90.82,60.45 90.82,60.98
N$825
  Top 0.025: 90.82,61.14 90.82,62.13
N$826
  Top 0.025: 90.79,50.01 90.79,48.54
N$827
  Top 0.025: 90.79,50.19 90.79,50.44
N$828
  Top 0.025: 90.79,50.83 90.79,51.36
N$829
  Top 0.025: 90.79,52.83 90.79,53.34
N$830
  Top 0.025: 90.79,53.7 90.79,54.23
N$831
  Top 0.025: 90.79,54.97 90.79,54.41
N$832
  Top 0.025: 90.79,55.83 90.79,56.39
N$833
  Top 0.025: 90.79,57.48 90.79,58.85
N$834
  Top 0.025: 90.79,59 90.79,59.56
N$835
  Top 0.025: 90.79,60.43 90.79,60.98
N$836
  Top 0.025: 90.79,61.14 90.79,62.15
N$837
  Top 0.025: 90.77,50.57 90.77,48.54
N$838
  Top 0.025: 90.77,50.88 90.77,51.36
N$839
  Top 0.025: 90.77,52.83 90.77,53.34
N$840
  Top 0.025: 90.77,53.7 90.77,54.23
N$841
  Top 0.025: 90.77,54.97 90.77,54.43
N$842
  Top 0.025: 90.77,55.83 90.77,56.36
N$843
  Top 0.025: 90.77,57.43 90.77,58.85
N$844
  Top 0.025: 90.77,59.03 90.77,59.56
N$845
  Top 0.025: 90.77,60.43 90.77,60.96
N$846
  Top 0.025: 90.77,61.14 90.77,62.18
N$847
  Top 0.025: 90.74,50.65 90.74,48.54
N$848
  Top 0.025: 90.74,50.93 90.74,51.38
N$849
  Top 0.025: 90.74,52.83 90.74,53.34
N$850
  Top 0.025: 90.74,53.7 90.74,54.23
N$851
  Top 0.025: 90.74,54.99 90.74,54.43
N$852
  Top 0.025: 90.74,55.83 90.74,56.36
N$853
  Top 0.025: 90.74,57.4 90.74,58.85
N$854
  Top 0.025: 90.74,59.03 90.74,59.59
N$855
  Top 0.025: 90.74,60.43 90.74,60.96
N$856
  Top 0.025: 90.74,61.14 90.74,62.2
N$857
  Top 0.025: 90.72,50.7 90.72,48.51
N$858
  Top 0.025: 90.72,50.98 90.72,51.38
N$859
  Top 0.025: 90.72,52.83 90.72,53.34
N$860
  Top 0.025: 90.72,53.67 90.72,54.2
N$861
  Top 0.025: 90.72,54.99 90.72,54.46
N$862
  Top 0.025: 90.72,55.8 90.72,56.34
N$863
  Top 0.025: 90.72,57.38 90.72,58.85
N$864
  Top 0.025: 90.72,59.05 90.72,59.59
N$865
  Top 0.025: 90.72,60.43 90.72,60.96
N$866
  Top 0.025: 90.72,62.23 90.72,61.14
N$867
  Top 0.025: 90.69,50.77 90.69,48.51
N$868
  Top 0.025: 90.69,51 90.69,51.38
N$869
  Top 0.025: 90.69,52.83 90.69,53.34
N$870
  Top 0.025: 90.69,53.67 90.69,54.2
N$871
  Top 0.025: 90.69,55.02 90.69,54.46
N$872
  Top 0.025: 90.69,55.8 90.69,56.34
N$873
  Top 0.025: 90.69,57.35 90.69,58.85
N$874
  Top 0.025: 90.69,59.05 90.69,59.61
N$875
  Top 0.025: 90.69,60.4 90.69,60.94
N$876
  Top 0.025: 90.69,62.23 90.69,61.14
N$877
  Top 0.025: 90.67,48.51 90.67,50.83
N$878
  Top 0.025: 90.67,51.05 90.67,51.38
N$879
  Top 0.025: 90.67,52.83 90.67,53.34
N$880
  Top 0.025: 90.67,53.67 90.67,54.18
N$881
  Top 0.025: 90.67,55.02 90.67,54.48
N$882
  Top 0.025: 90.67,55.8 90.67,56.34
N$883
  Top 0.025: 90.67,57.35 90.67,58.85
N$884
  Top 0.025: 90.67,59.08 90.67,59.61
N$885
  Top 0.025: 90.67,60.4 90.67,60.94
N$886
  Top 0.025: 90.67,62.26 90.67,61.14
N$887
  Top 0.025: 90.64,48.51 90.64,50.85
N$888
  Top 0.025: 90.64,51.08 90.64,51.38
N$889
  Top 0.025: 90.64,52.83 90.64,53.34
N$890
  Top 0.025: 90.64,53.67 90.64,54.18
N$891
  Top 0.025: 90.64,55.04 90.64,54.48
N$892
  Top 0.025: 90.64,55.78 90.64,56.31
N$893
  Top 0.025: 90.64,57.33 90.64,58.85
N$894
  Top 0.025: 90.64,59.08 90.64,59.64
N$895
  Top 0.025: 90.64,60.4 90.64,60.91
N$896
  Top 0.025: 90.64,62.26 90.64,61.11
N$897
  Top 0.025: 90.61,48.51 90.61,50.9
N$898
  Top 0.025: 90.61,51.13 90.61,51.38
N$899
  Top 0.025: 90.61,52.83 90.61,53.34
N$900
  Top 0.025: 90.61,53.65 90.61,54.15
N$901
  Top 0.025: 90.61,55.04 90.61,54.51
N$902
  Top 0.025: 90.61,55.78 90.61,56.31
N$903
  Top 0.025: 90.61,57.3 90.61,58.85
N$904
  Top 0.025: 90.61,59.11 90.61,59.64
N$905
  Top 0.025: 90.61,60.38 90.61,60.91
N$906
  Top 0.025: 90.61,62.26 90.61,61.11
N$907
  Top 0.025: 90.59,48.51 90.59,50.95
N$908
  Top 0.025: 90.59,51.16 90.59,51.38
N$909
  Top 0.025: 90.59,52.83 90.59,53.34
N$910
  Top 0.025: 90.59,53.65 90.59,54.15
N$911
  Top 0.025: 90.59,55.07 90.59,54.51
N$912
  Top 0.025: 90.59,55.78 90.59,56.31
N$913
  Top 0.025: 90.59,57.3 90.59,58.01
N$914
  Top 0.025: 90.59,58.29 90.59,58.85
N$915
  Top 0.025: 90.59,59.11 90.59,59.66
N$916
  Top 0.025: 90.59,60.38 90.59,60.91
N$917
  Top 0.025: 90.59,61.11 90.59,61.42
N$918
  Top 0.025: 90.59,62.28 90.59,61.65
N$919
  Top 0.025: 90.56,48.51 90.56,50.98
N$920
  Top 0.025: 90.56,51.18 90.56,51.38
N$921
  Top 0.025: 90.56,52.86 90.56,53.34
N$922
  Top 0.025: 90.56,53.65 90.56,54.13
N$923
  Top 0.025: 90.56,55.07 90.56,54.53
N$924
  Top 0.025: 90.56,55.75 90.56,56.29
N$925
  Top 0.025: 90.56,57.28 90.56,57.94
N$926
  Top 0.025: 90.56,58.37 90.56,58.85